# EAGLE schematic dual-relay-a-1 (EAGLE 9.6.2)
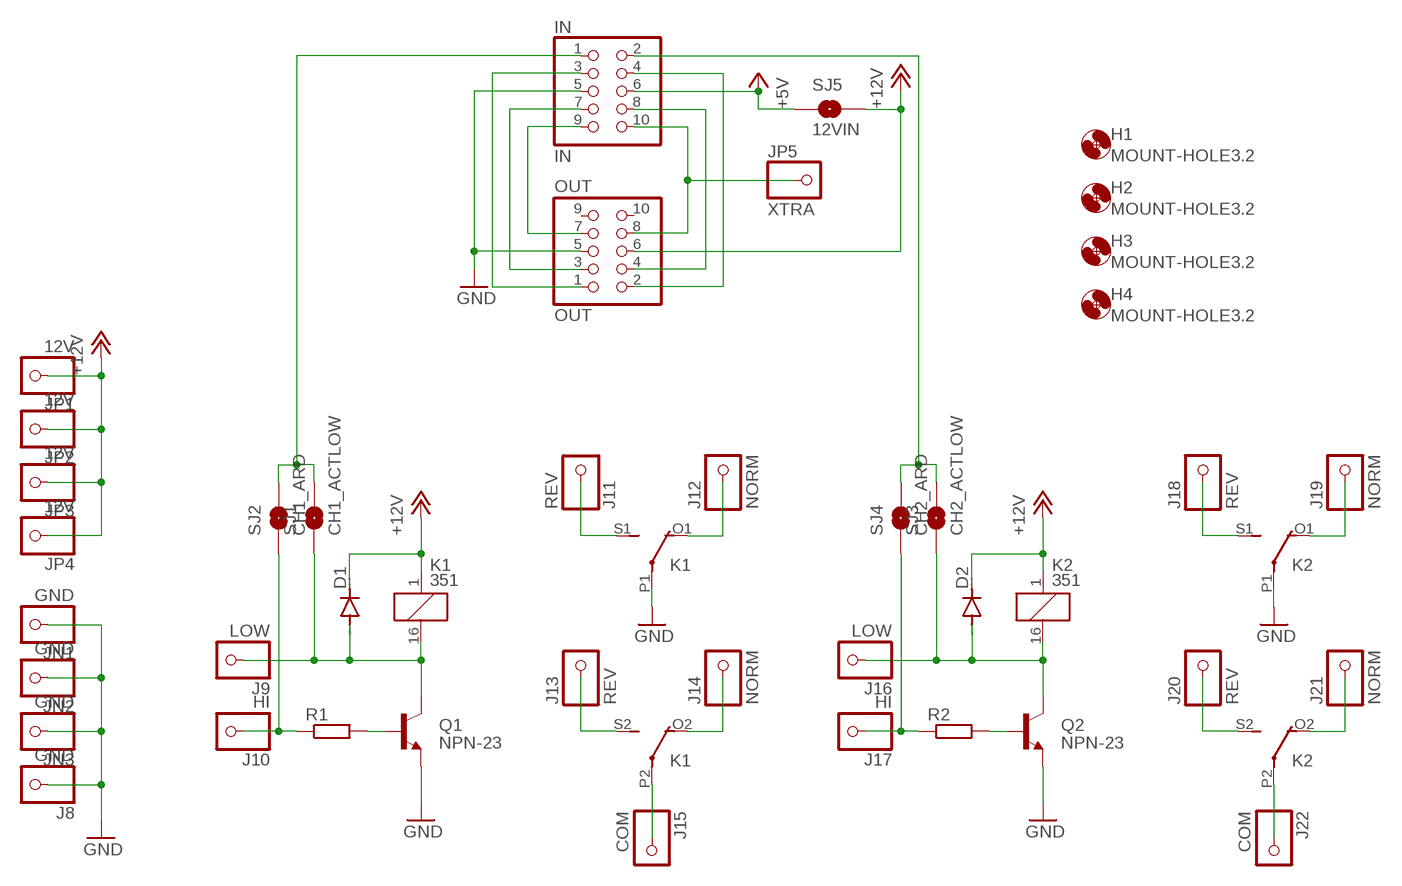
[diagram p0: schematic, sheet 1]

## Parts
D1  DIODE-MINIMELF  [MINIMELF]
D2  DIODE-MINIMELF  [MINIMELF]
H1  MOUNT-HOLE3.2  [3,2]
H2  MOUNT-HOLE3.2  [3,2]
H3  MOUNT-HOLE3.2  [3,2]
H4  MOUNT-HOLE3.2  [3,2]
IN  IN  PINHD-2X5CN  [CON10M]
J8  GND  LARGE-SOLDERPAD  [LARGE-SOLDERPAD]
J9  LOW  LARGE-SOLDERPAD  [LARGE-SOLDERPAD]
J10  HI  LARGE-SOLDERPAD  [LARGE-SOLDERPAD]
J11  REV  LARGE-SOLDERPAD  [LARGE-SOLDERPAD]
J12  NORM  LARGE-SOLDERPAD  [LARGE-SOLDERPAD]
J13  REV  LARGE-SOLDERPAD  [LARGE-SOLDERPAD]
J14  NORM  LARGE-SOLDERPAD  [LARGE-SOLDERPAD]
J15  COM  LARGE-SOLDERPAD  [LARGE-SOLDERPAD]
J16  LOW  LARGE-SOLDERPAD  [LARGE-SOLDERPAD]
J17  HI  LARGE-SOLDERPAD  [LARGE-SOLDERPAD]
J18  REV  LARGE-SOLDERPAD  [LARGE-SOLDERPAD]
J19  NORM  LARGE-SOLDERPAD  [LARGE-SOLDERPAD]
J20  REV  LARGE-SOLDERPAD  [LARGE-SOLDERPAD]
J21  NORM  LARGE-SOLDERPAD  [LARGE-SOLDERPAD]
J22  COM  LARGE-SOLDERPAD  [LARGE-SOLDERPAD]
JN1  GND  LARGE-SOLDERPAD  [LARGE-SOLDERPAD]
JN2  GND  LARGE-SOLDERPAD  [LARGE-SOLDERPAD]
JN3  GND  LARGE-SOLDERPAD  [LARGE-SOLDERPAD]
JP1  12V  LARGE-SOLDERPAD  [LARGE-SOLDERPAD]
JP2  12V  LARGE-SOLDERPAD  [LARGE-SOLDERPAD]
JP3  12V  LARGE-SOLDERPAD  [LARGE-SOLDERPAD]
JP4  12V  LARGE-SOLDERPAD  [LARGE-SOLDERPAD]
JP5  XTRA  LARGE-SOLDERPAD  [LARGE-SOLDERPAD]
K1  351  [351]
K2  351  [351]
OUT  OUT  PINHD-2X5CN  [CON10M]
Q1  NPN-23  [SOT23]
Q2  NPN-23  [SOT23]
R1  R-EU_R0805  [R0805]
R2  R-EU_R0805  [R0805]
SJ1  CH1_ACTLOW  SJRND2  [SJ_RND2]
SJ2  CH1_ARD  SJRND2  [SJ_RND2]
SJ3  CH2_ACTLOW  SJRND2  [SJ_RND2]
SJ4  CH2_ARD  SJRND2  [SJ_RND2]
SJ5  12VIN  SJRND2  [SJ_RND2]

## Nets
+5V: IN.6 SJ5.P$1
+12V: D1.C D2.C JP1.P$1 JP2.P$1 JP3.P$1 JP4.P$1 K1.1 K2.1 OUT.6 SJ5.P$2
GND: IN.5 K1.P1(2:P) K2.P1(2:P) OUT.5 Q1.2(E) Q2.2(E)
JN4: J8.P$1 JN1.P$1 JN2.P$1 JN3.P$1 ; supply symbol labelled GND
N$1: D1.A J9.P$1 K1.16 Q1.3(C) SJ1.P$1
N$2: J10.P$1 R1.1 SJ2.P$1
N$3: Q1.1(B) R1.2
N$4: J11.P$1 K1.S1(2:S)
N$5: J12.P$1 K1.O1(2:O)
N$6: J13.P$1 K1.S2(3:S)
N$7: J14.P$1 K1.O2(3:O)
N$8: J15.P$1 K1.P2(3:P)
N$9: D2.A J16.P$1 K2.16 Q2.3(C) SJ3.P$1
N$10: J17.P$1 R2.1 SJ4.P$1
N$11: Q2.1(B) R2.2
N$12: J18.P$1 K2.S1(2:S)
N$13: J19.P$1 K2.O1(2:O)
N$14: J20.P$1 K2.S2(3:S)
N$15: J21.P$1 K2.O2(3:O)
N$16: J22.P$1 K2.P2(3:P)
N$17: IN.1 SJ1.P$2 SJ2.P$2
N$18: IN.2 SJ3.P$2 SJ4.P$2
N$19: IN.3 OUT.1
N$20: IN.7 OUT.3
N$21: IN.8 OUT.4
N$22: IN.10 JP5.P$1 OUT.8
N$83: IN.4 OUT.2
N$84: IN.9 OUT.7
Unconnected: OUT.9 OUT.10

## Library data of the parts
D1 D2 = diode:DIODE-: DIODE
H1-H4 = holes:MOUNT-HOLE: MOUNTING HOLE with drill center marker
IN OUT = trainlib:PINHD-2X5: PIN HEADER
J8-J22 JN1-JN3 JP1-JP5 = eagleparts:LARGE-SOLDERPAD
K1 K2 = relay:351: RELAY 2 x switch, Omron; OC_FARNELL: unknown; OC_NEWARK: unknown
Q1 Q2 = eagleparts:NPN-23
R1 R2 = rcl:R-EU_: RESISTOR, European symbol; SPICEPREFIX: R
SJ1-SJ5 = trainlib:SJ: SMD solder JUMPER